# Altium schematic sheet MCU.SchDoc
size A3; SheetNumber: 3
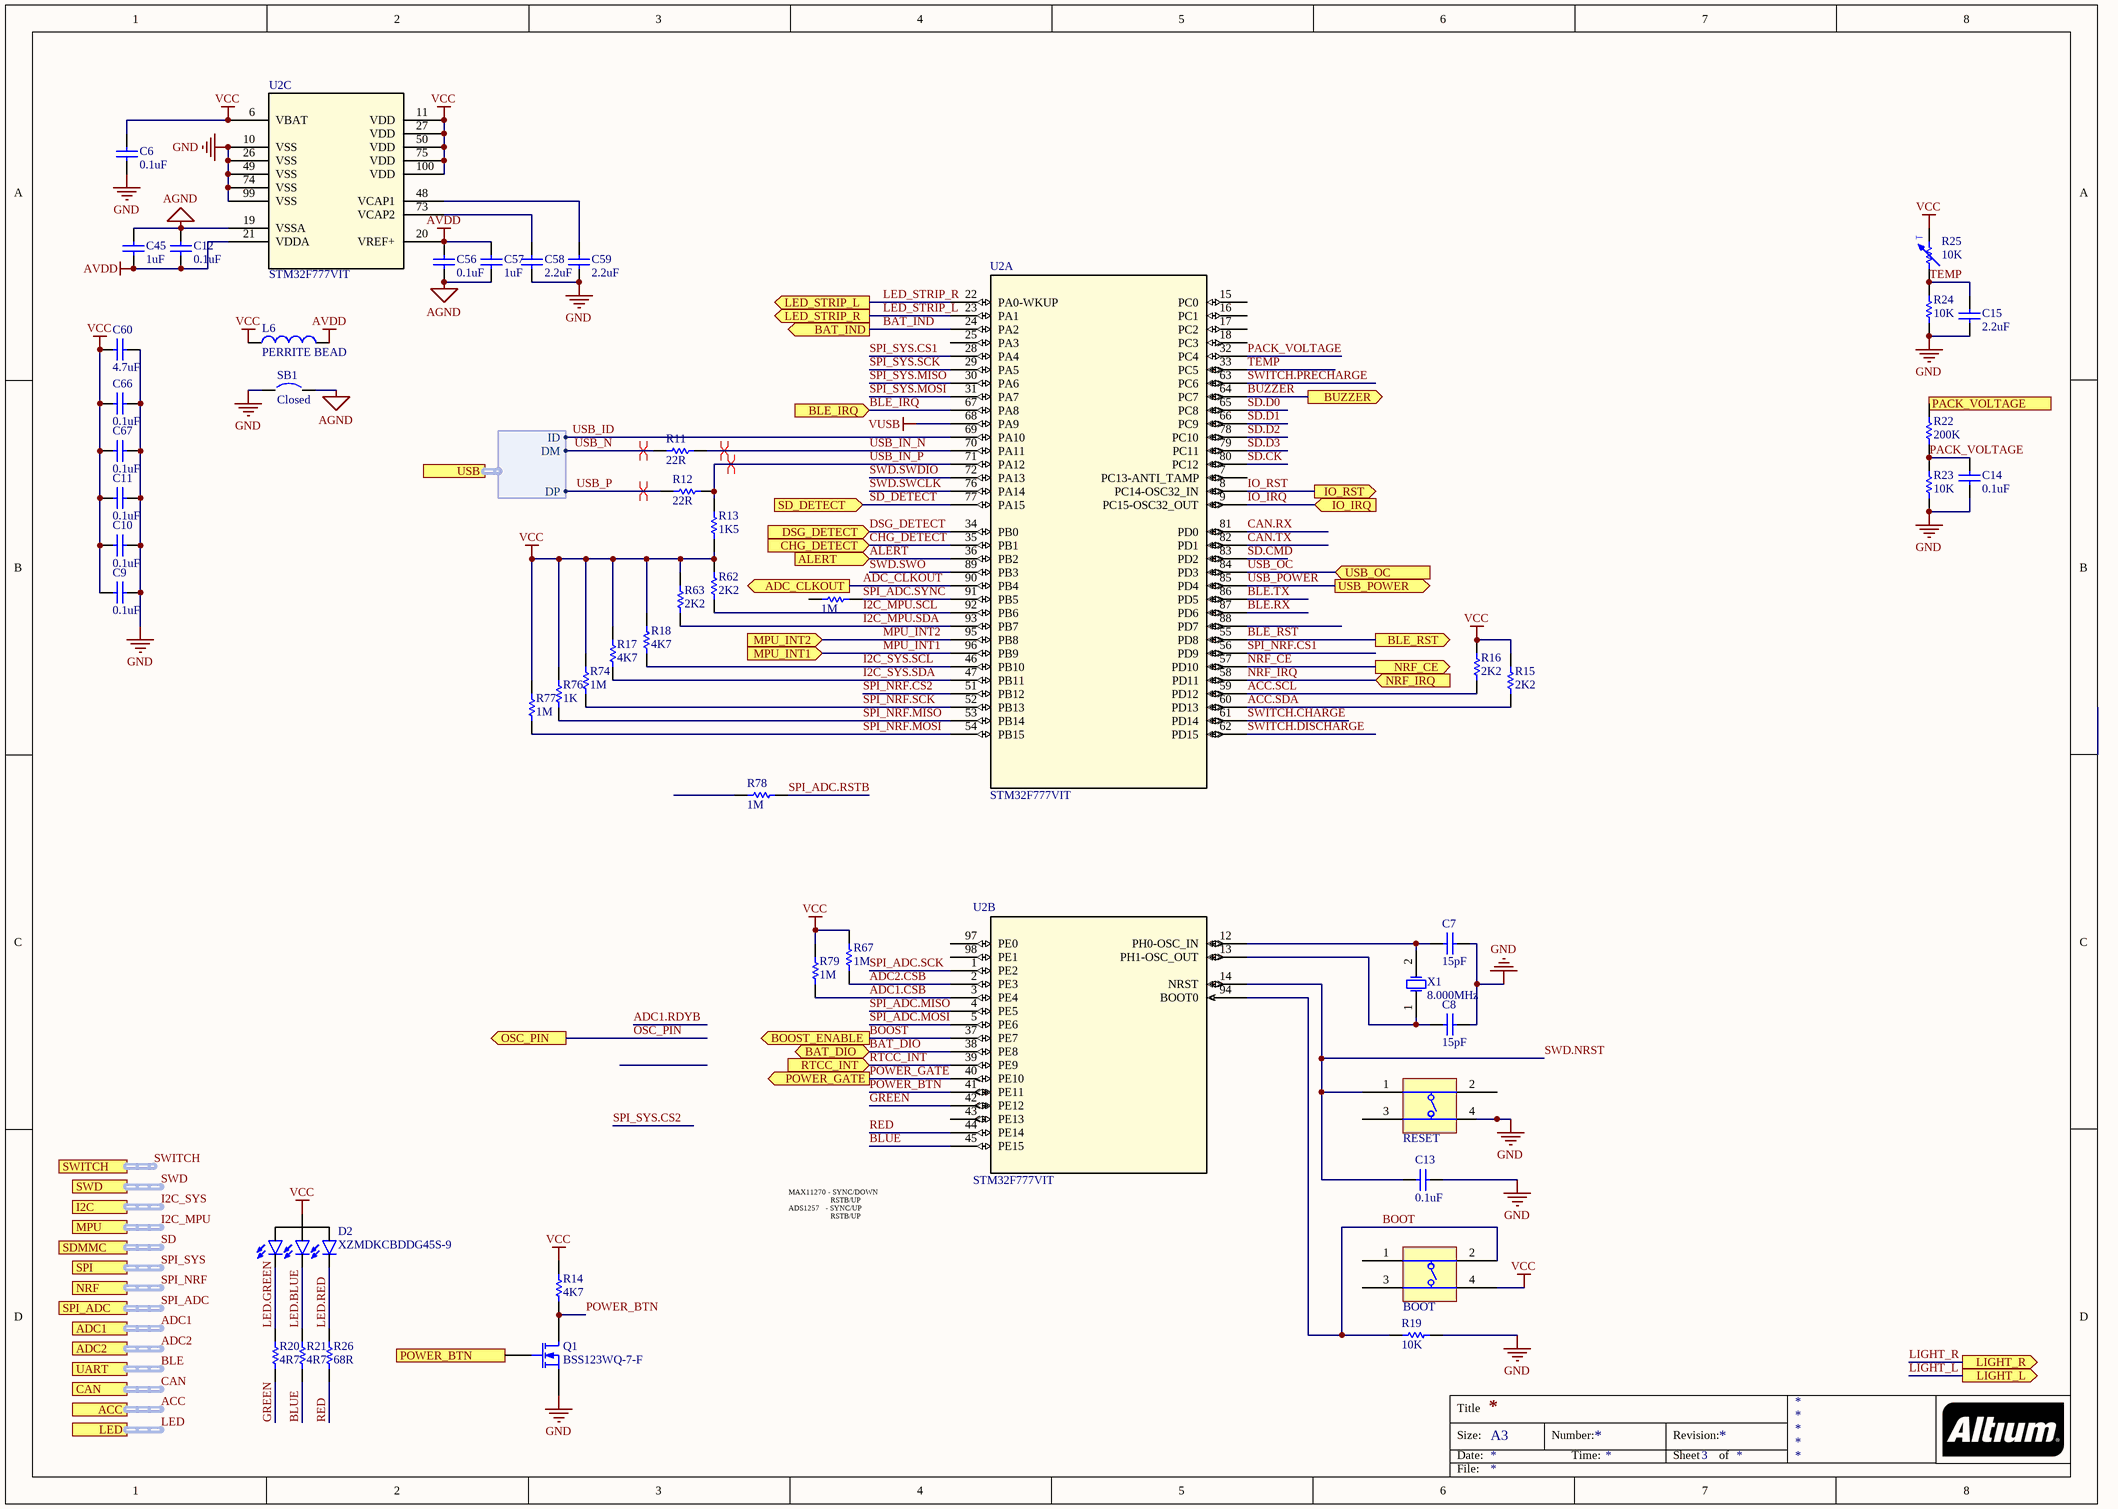
[diagram p0: MCU.SchDoc]

## Parts
BOOT  DIPT-DTSM-6  [SWITCH]  (value not drawn)
C6  value 0.1uF  [C0603[1608X92]]  (hidden comment: 0.1uF 6.3V 0603)
C7  value 15pF  [C0603[1608X92]]  (hidden comment: 15pF 50V 0603)
C8  value 15pF  [C0603[1608X92]]  (hidden comment: 15pF 50V 0603)
C9  value 0.1uF  [C0603[1608X92]]  (hidden comment: 0.1uF 6.3V 0603)
C10  value 0.1uF  [C0603[1608X92]]  (hidden comment: 0.1uF 6.3V 0603)
C11  value 0.1uF  [C0603[1608X92]]  (hidden comment: 0.1uF 6.3V 0603)
C12  value 0.1uF  [C0603[1608X92]]  (hidden comment: 0.1uF 6.3V 0603)
C13  value 0.1uF  [C0603[1608X92]]  (hidden comment: 0.1uF 6.3V 0603)
C14  value 0.1uF  [C0603[1608X92]]  (hidden comment: 0.1uF 6.3V 0603)
C15  value 2.2uF  [C0603[1608X92]]  (hidden comment: 2.2uF 6.3V 0603)
C45  value 1uF  [C0603[1608X92]]  (hidden comment: 1uF 6.3V 0603)
C56  value 0.1uF  [C0603[1608X92]]  (hidden comment: 0.1uF 6.3V 0603)
C57  value 1uF  [C0603[1608X92]]  (hidden comment: 1uF 6.3V 0603)
C58  value 2.2uF  [C1206[3216X160]]  (hidden comment: 2.2uF 16V 1206)
C59  value 2.2uF  [C1206[3216X160]]  (hidden comment: 2.2uF 16V 1206)
C60  value 4.7uF  [C0603[1608X92]]  (hidden comment: 4.7uF 6.3V 0603)
C66  value 0.1uF  [C0603[1608X92]]  (hidden comment: 0.1uF 6.3V 0603)
C67  value 0.1uF  [C0603[1608X92]]  (hidden comment: 0.1uF 6.3V 0603)
D2  XZMDKCBDDG45S-9  [XZMDKCBDDG45S-9]
L6  Type: PERRITE BEAD  [IND0603]  (hidden comment: 33Ohm)
Q1  BSS123WQ-7-F  [SOT323-3]
R11  value 22R  [R0603[1608]]  (hidden comment: 22R 1% 0603)
R12  value 22R  [R0603[1608]]  (hidden comment: 22R 1% 0603)
R13  value 1K5  [R0603[1608]]  (hidden comment: 1K5 1% 0603)
R14  value 4K7  [R0603[1608]]  (hidden comment: 4K7 1% 0603)
R15  value 2K2  [R0603[1608]]  (hidden comment: 2K2 1% 0603)
R16  value 2K2  [R0603[1608]]  (hidden comment: 2K2 1% 0603)
R17  value 4K7  [R0603[1608]]  (hidden comment: 4K7 1% 0603)
R18  value 4K7  [R0603[1608]]  (hidden comment: 4K7 1% 0603)
R19  value 10K  [R0603[1608]]  (hidden comment: 10K 1% 0603)
R20  value 4R7  [R0603[1608]]  (hidden comment: 4R7 5% 0603)
R21  value 4R7  [R0603[1608]]  (hidden comment: 4R7 5% 0603)
R22  value 200K  [R0603[1608]]  (hidden comment: 200K 1% 0603)
R23  value 10K  [R0603[1608]]  (hidden comment: 10K 1% 0603)
R24  value 10K  [R0603[1608]]  (hidden comment: 10K 1% 0603)
R25  value 10K  [R0603[1608]]  (hidden comment: 10K 0.5% 0603)
R26  value 68R  [R0603[1608]]  (hidden comment: 68R 1% 0603)
R62  value 2K2  [R0603[1608]]  (hidden comment: 2K2 1% 0603)
R63  value 2K2  [R0603[1608]]  (hidden comment: 2K2 1% 0603)
R67  value 1M  [R0603[1608]]  (hidden comment: 1M 5% 0603)
R74  value 1M  [R0603[1608]]  (hidden comment: 1M 5% 0603)
R75  value 1M  [R0603[1608]]  (hidden comment: 1M 5% 0603)
R76  value 1K  [R0603[1608]]  (hidden comment: 1K 1% 0603)
R77  value 1M  [R0603[1608]]  (hidden comment: 1M 5% 0603)
R78  value 1M  [R0603[1608]]  (hidden comment: 1M 5% 0603)
R79  value 1M  [R0603[1608]]  (hidden comment: 1M 5% 0603)
RESET  DIPT-DTSM-6  [SWITCH]  (value not drawn)
SB1  Closed  [SB_0603]
U2  STM32F777VIT  [LQFP-100_14X14mm]  (parts A,B,C of 3)
X1  8.000MHz  [OSC_2SM_3R2x2R5]

## Ports
ACC (harness Accessory Outputs), ADC1 (harness ADC), ADC2 (harness ADC), ADC_CLKOUT (out), ALERT (in), BAT_DIO (bidir), BAT_IND (out), BLE_IRQ (in), BLE_RST (out), BOOST_ENABLE (out), BUZZER (out), CAN (harness CAN Input), CHG_DETECT (in), DSG_DETECT (in), I2C (harness I2C), IO_IRQ (in), IO_RST (out), LED (harness LED), LED_STRIP_L (out), LED_STRIP_R (out), LIGHT_L (out), LIGHT_R (out), MPU (harness I2C), MPU_INT1 (in), MPU_INT2 (in), NRF (harness SPI), NRF_CE (out), NRF_IRQ (in), OSC_PIN (out), PACK_VOLTAGE (in), POWER_BTN (in), POWER_GATE (out), RTCC_INT (in), SD_DETECT (in), SDMMC (harness SDMMC), SPI (harness SPI), SPI_ADC (harness SPI_ADC), SWD (harness SWD), SWITCH (harness Switches), UART (harness USART2), USB (harness USB), USB_OC (in), USB_POWER (out)

## Harnesses
USB: DM, DP, ID

## Nets
AGND: C12.2 C45.2 C56.1 C57.1 SB1.2 U2.19(VSSA)
AVDD: C12.1 C45.1 C56.2 C57.2 L6.2 U2.20(VREF+) U2.21(VDDA)
GND: C6.1 C7.2 C8.2 C9.2 C10.2 C11.2 C13.2 C14.1 C15.1 C58.1 C59.1 C60.2 C66.2 C67.2 Q1.2(S) R19.2 R23.1 R24.1 RESET.4 SB1.1 U2.10(VSS) U2.26(VSS) U2.49(VSS) U2.74(VSS) U2.99(VSS)
VCC: BOOT.4 C6.2 C9.1 C10.1 C11.1 C60.1 C66.1 C67.1 D2.2(A) L6.1 R13.1 R14.2 R15.1 R16.1 R17.2 R18.2 R25.2 R62.1 R63.1 R67.1 R74.1 R76.1 R77.1 R79.1 U2.6(VBAT) U2.11(VDD) U2.27(VDD) U2.50(VDD) U2.75(VDD) U2.100(VDD)
VUSB: U2.68(PA9)
ACC.SCL: R16.2 U2.59(PD12)
ACC.SDA: R15.2 U2.60(PD13)
ADC1.CSB: R79.2 U2.3(PE4)
ADC2.CSB: R67.2 U2.2(PE3)
ADC_CLKOUT: U2.90(PB4) ; port ADC_CLKOUT
ALERT: U2.36(PB2) ; port ALERT
BAT_DIO: U2.38(PE8) ; port BAT_DIO
BAT_IND: U2.24(PA2) ; port BAT_IND
BLE.RX: U2.87(PD6)
BLE.TX: U2.86(PD5)
BLE_IRQ: U2.67(PA8) ; port BLE_IRQ
BLE_RST: U2.55(PD8) ; port BLE_RST
BLUE: R21.1 U2.45(PE15)
BOOST: U2.37(PE7) ; port BOOST_ENABLE
BOOT: BOOT.2 R19.1 U2.94(BOOT0)
BUZZER: U2.64(PC7) ; port BUZZER
CAN.RX: U2.81(PD0)
CAN.TX: U2.82(PD1)
CHG_DETECT: U2.35(PB1) ; port CHG_DETECT
DSG_DETECT: U2.34(PB0) ; port DSG_DETECT
GREEN: R20.1 U2.42(PE12)
I2C_MPU.SCL: R62.2 U2.92(PB6)
I2C_MPU.SDA: R63.2 U2.93(PB7)
I2C_SYS.SCL: R18.1 U2.46(PB10)
I2C_SYS.SDA: R17.1 U2.47(PB11)
IO_IRQ: U2.9(PC15-OSC32_OUT) ; port IO_IRQ
IO_RST: U2.8(PC14-OSC32_IN) ; port IO_RST
LED.BLUE: D2.3(K_Blue) R21.2
LED.GREEN: D2.4(K_Green) R20.2
LED.RED: D2.1(K_Red) R26.2
LED_STRIP_L: U2.23(PA1) ; port LED_STRIP_R
LED_STRIP_R: U2.22(PA0-WKUP) ; port LED_STRIP_L
LIGHT_L: port LIGHT_L
LIGHT_R: port LIGHT_R
MPU_INT1: U2.96(PB9) ; port MPU_INT1
MPU_INT2: U2.95(PB8) ; port MPU_INT2
NRF_CE: U2.57(PD10) ; port NRF_CE
NRF_IRQ: U2.58(PD11) ; port NRF_IRQ
OSC_PIN: port OSC_PIN
PACK_VOLTAGE: C14.2 R22.1 R23.2 U2.32(PC4)
PACK_VOLTAGE: R22.2 ; port PACK_VOLTAGE  [a separate net that carries the same name]
POWER_BTN: Q1.3(D) R14.1 U2.41(PE11)
POWER_BTN: Q1.1(G) ; port POWER_BTN  [a separate net that carries the same name]
POWER_GATE: U2.40(PE10) ; port POWER_GATE
RED: R26.1 U2.44(PE14)
RTCC_INT: U2.39(PE9) ; port RTCC_INT
SD.CK: U2.80(PC12)
SD.CMD: U2.83(PD2)
SD.D0: U2.65(PC8)
SD.D1: U2.66(PC9)
SD.D2: U2.78(PC10)
SD.D3: U2.79(PC11)
SD_DETECT: U2.77(PA15) ; port SD_DETECT
SPI_ADC.MISO: U2.4(PE5)
SPI_ADC.MOSI: U2.5(PE6)
SPI_ADC.RSTB: R78.1
SPI_ADC.SCK: U2.1(PE2)
SPI_ADC.SYNC: R75.2 U2.91(PB5)
SPI_NRF.CS1: U2.56(PD9)
SPI_NRF.CS2: U2.51(PB12)
SPI_NRF.MISO: R76.2 U2.53(PB14)
SPI_NRF.MOSI: R77.2 U2.54(PB15)
SPI_NRF.SCK: R74.2 U2.52(PB13)
SPI_SYS.CS1: U2.28(PA4)
SPI_SYS.MISO: U2.30(PA6)
SPI_SYS.MOSI: U2.31(PA7)
SPI_SYS.SCK: U2.29(PA5)
SWD.NRST: C13.1 RESET.1 U2.14(NRST)
SWD.SWCLK: U2.76(PA14)
SWD.SWDIO: U2.72(PA13)
SWD.SWO: U2.89(PB3)
SWITCH.CHARGE: U2.61(PD14)
SWITCH.DISCHARGE: U2.62(PD15)
SWITCH.PRECHARGE: U2.63(PC6)
TEMP: C15.2 R24.2 R25.1 U2.33(PC5)
USB_ID: U2.69(PA10) ; port USB.ID
USB_IN_N: R11.2 U2.70(PA11)
USB_IN_P: R12.2 R13.2 U2.71(PA12)
USB_N: R11.1 ; port USB.DM
USB_OC: U2.84(PD3) ; port USB_OC
USB_P: R12.1 ; port USB.DP
USB_POWER: U2.85(PD4) ; port USB_POWER
NetC7_1: C7.1 U2.12(PH0-OSC_IN) X1.2(OSC2)
NetC8_1: C8.1 U2.13(PH1-OSC_OUT) X1.1(OSC1)
NetC58_2: C58.2 U2.73(VCAP2)
NetC59_2: C59.2 U2.48(VCAP1)

Not connected (* = marked no-connect by the designer): BOOT 1 3; R75 1; R78 2; RESET 2 3; U2 7(PC13-ANTI_TAMP) 15(PC0) 16(PC1) 17(PC2) 18(PC3) 25(PA3) 43(PE13) 88(PD7) 97(PE0) 98(PE1)

## Buses and harness runs
harness ACC = port ACC
harness ADC1 = port ADC1
harness ADC2 = port ADC2
harness BLE = port UART
harness CAN = port CAN
harness I2C_MPU = port MPU
harness I2C_SYS = port I2C
harness LED = port LED
harness SD = port SDMMC
harness SPI_ADC = port SPI_ADC
harness SPI_NRF = port NRF
harness SPI_SYS = port SPI
harness SWD = port SWD
harness SWITCH = port SWITCH

## Layout directives
differential pair; rule Width Constraint [Pref Width = 10mil    Min Width = 10mil    Max Width = 10mil]: USB_N
differential pair: USB_IN_N, USB_IN_P, USB_P

## Notes on the sheet
- MAX11270 - SYNC/DOWN
  RSTB/UP
  ADS1257   - SYNC/UP
  RSTB/UP
- Title
- Size:
- Date:
- A3
- Number:
- Time:
- Revision:
- Sheet
- of
- File:
- (in symbol NTC_10K_0603_0.5%) T

## Library data of the parts
BOOT RESET = DIPT-DTSM-6: Switch, SPNO Push Button SMD; Manufacturer: C&K Components; PartNumber: PTS810 SJM 250 SMTR LFS; PackageReference: PTS810
C6 C9-C14 C56 C66 C67 = CAP_0.1uF_6.3V_0603_10%: 0.1uF 6.3V 10% 0603 (1608 Metric); PartNumber: GRM188R70J104KA01D; Manufacturer: Murata; Mounting Technology: Surface Mount; PackageReference: 0603; PackageDescription: 0603 (1608 Metric); Voltage: 6.3V; Tolerance: 10%
C7 C8 = CAP_15pF_50V_0603_1%: 15pF 50V 1% 0603 (1608 Metric); PartNumber: 06035A150FAT2A; Manufacturer: AVX Corporation; TemperatureCoefficient: C0G; Mounting Technology: Surface Mount; PackageReference: 0603; PackageDescription: 0603 (1608 Metric); Voltage: 50V; Tolerance: 1%
C15 = CAP_2.2uF_6.3V_0603_10%: 2.2uF 6.3V 10% 0603 (1608 Metric); PartNumber: GRM185R60J225KE26D; Manufacturer: Murata; TemperatureCoefficient: X5R; Mounting Technology: Surface Mount; PackageReference: 0603; PackageDescription: 0603 (1608 Metric); Voltage: 6.3V; Tolerance: 10%
C45 C57 = CAP_1uF_6.3V_0603_10%: 1uF 6.3V 10% 0603 (1608 Metric); PartNumber: GRM188R60J105KA01D; Manufacturer: Murata; TemperatureCoefficient: X5R; Mounting Technology: Surface Mount; PackageReference: 0603; PackageDescription: 0603 (1608 Metric); Voltage: 6.3V; Tolerance: 10%
C58 C59 = CAP_2.2uF_16V_1206_10%: 2.2uF 16V 10% X7R 1206 (3216 Metric); PartNumber: C1206C225K4RACAUTO; Manufacturer: KEMET; Mounting Technology: Surface Mount; PackageReference: 1206; PackageDescription: 1206 (3216 Metric); Voltage: 16V; Tolerance: 10%
C60 = CAP_4.7uF_6.3V_0603_10%: 4.7uF 6.3V 10% 0603 (1608 Metric); PartNumber: GRM188R60J475KE19J; Manufacturer: Murata; TemperatureCoefficient: X5R; Mounting Technology: Surface Mount; PackageReference: 0603; PackageDescription: 0603 (1608 Metric); Voltage: 6.3V; Tolerance: 10%
D2 = XZMDKCBDDG45S-9: Manufacturer: SunLED; PartNumber: XZMDKCBDDG45S-9; PackageReference: 4-PLCC; Mounting Technology: Surface Mount; PackageDescription: 4-SMD, Gull Wing,  3.20mm L x 2.80mm W
L6 = PER_33Ohm_3A_0603: 33Ohm 3A 0603 Perrite Bead; Manufacturer: Murata; PartNumber: BLM18PG330SN1D; PackageReference: 0603; PackageDescription: 0603 (1608 metric); Mounting Technology: Surface Mount; Current: 3A; Value: 33Ohm
Q1 = BSS123WQ-7-F: N-Channel MOSFET; Manufacturer: Diodes Incorporated; PackageReference: SOT-323-3; PartNumber: BSS123WQ-7-F; Mounting Technology: Surface Mount
R11 R12 = RES_22R_0603_1%: 22R 0.25W 1% 0603 (1005 Metric); Manufacturer: Vishay / Dale; PartNumber: CRCW060322R0FKEAHP; Tolerance: 1%; Power: 0.25W; Mounting Technology: Surface Mount; PackageReference: 0603; PackageDescription: 0603 (1608 Metric); ComponentLink1Description: Datasheet; ComponentLink1URL: http://www.vishay.com/docs/20043/crcwhpe3.pdf
R13 = RES_1K5_0603_1%: 1K5 0.25W 1% 0603 (1005 Metric); Manufacturer: Vishay / Dale; PartNumber: CRCW06031K50FKEAHP; Tolerance: 1%; Power: 0.25W; Mounting Technology: Surface Mount; PackageReference: 0603; PackageDescription: 0603 (1608 Metric); ComponentLink1Description: Datasheet; ComponentLink1URL: http://www.vishay.com/docs/20043/crcwhpe3.pdf
R14 R17 R18 = RES_4K7_0603_1%: 4K7 0.25W 1% 0603 (1005 Metric); Manufacturer: Vishay / Dale; PartNumber: CRCW06034K70FKEAHP; Tolerance: 1%; Power: 0.25W; Mounting Technology: Surface Mount; PackageReference: 0603; PackageDescription: 0603 (1608 Metric); ComponentLink1Description: Datasheet; ComponentLink1URL: http://www.vishay.com/docs/20043/crcwhpe3.pdf
R15 R16 R62 R63 = RES_2K2_0603_1%: 2K2 0.25W 1% 0603 (1005 Metric); Manufacturer: Vishay / Dale; PartNumber: CRCW06032K20FKEAHP; Tolerance: 1%; Power: 0.25W; Mounting Technology: Surface Mount; PackageReference: 0603; PackageDescription: 0603 (1608 Metric); ComponentLink1Description: Datasheet; ComponentLink1URL: http://www.vishay.com/docs/20043/crcwhpe3.pdf
R19 R23 R24 = RES_10K_0603_1%: 10K 0.25W 1% 0603 (1005 Metric); Manufacturer: Vishay / Dale; PartNumber: CRCW060310K0FKEAHP; Tolerance: 1%; Power: 0.25W; Mounting Technology: Surface Mount; PackageReference: 0603; PackageDescription: 0603 (1608 Metric); ComponentLink1Description: Datasheet; ComponentLink1URL: http://www.vishay.com/docs/20065/rcse3.pdf
R20 R21 = RES_4R7_0603_5%: 4R7 0.25W 5% 0603 (1005 Metric); Manufacturer: Rohm; PartNumber: ESR03EZPJ4R7; Tolerance: 5%; Power: 0.25W; Mounting Technology: Surface Mount; PackageReference: 0603; PackageDescription: 0603 (1608 Metric); ComponentLink1Description: Datasheet; ComponentLink1URL: http://www.vishay.com/docs/20043/crcwhpe3.pdf
R22 = RES_200K_0603_1%: 200K 0.25W 1% 0603 (1005 Metric); Manufacturer: Rohm Semiconductor; PartNumber: ESR03EZPJ204; Tolerance: 5%; Power: 0.25W; Mounting Technology: Surface Mount; PackageReference: 0603; PackageDescription: 0603 (1608 Metric); ComponentLink1Description: Datasheet; ComponentLink1URL: http://www.vishay.com/docs/20043/crcwhpe3.pdf
R25 = NTC_10K_0603_0.5%: NTC 10K 0.5% 0603 (1608 Metric); PartNumber: NCP18XH103D60RC; Manufacturer: Murata; Power: 0.1W; Mounting Technology: Surface Mount; PackageReference: 0603; PackageDescription: 0603 (1608 Metric); Tolerance: 0.5%
R26 = RES_68R_0603_1%: 68R 0.25W 1% 0603 (1005 Metric); Manufacturer: Panasonic; PartNumber: ERJ-PA3F68R0V; Tolerance: 1%; Power: 0.25W; Mounting Technology: Surface Mount; PackageReference: 0603; PackageDescription: 0603 (1608 Metric); ComponentLink1Description: Datasheet; ComponentLink1URL: http://www.vishay.com/docs/20043/crcwhpe3.pdf
R67 R74 R75 R77-R79 = RES_1M_0603_5%: 1M 0.25W 5% 0603 (1005 Metric); Manufacturer: Panasonic; PartNumber: ERJ-PA3J105V; Tolerance: 5%; Power: 0.25W; Mounting Technology: Surface Mount; PackageReference: 0603; PackageDescription: 0603 (1608 Metric); ComponentLink1Description: Datasheet; ComponentLink1URL: http://www.vishay.com/docs/20043/crcwhpe3.pdf
R76 = RES_1K_0603_1%: 1K 0.25W 1% 0603 (1005 Metric); Manufacturer: Vishay / Dale; PartNumber: CRCW06031K00FKEAHP; Tolerance: 1%; Power: 0.25W; Mounting Technology: Surface Mount; PackageReference: 0603; PackageDescription: 0603 (1608 Metric); ComponentLink1Description: Datasheet; ComponentLink1URL: http://www.vishay.com/docs/20043/crcwhpe3.pdf
SB1 = Circuit Breaker_close: Circuit Breaker; Published: 24-Mar-1999; Revision: July-2002: Re-released for DXP Platform.; Publisher: Altium Limited
U2 = STM32F777VIT: Imported; Manufacturer: STMicroelectronics; Value: Value; Type: Type; RefDes: RefDes; PartNumber: STM32F777VIT
X1 = XTAL_NX3225GD_8MHZ: Crystal Oscillator; Manufacturer: NX; PartNumber: NX3225GD-8MHZ-STD-CRA-3; PackageReference: 2-SMD; Value: 8.000MHz